# Altium schematic sheet Schmeiser Robo.SchDoc
size A3
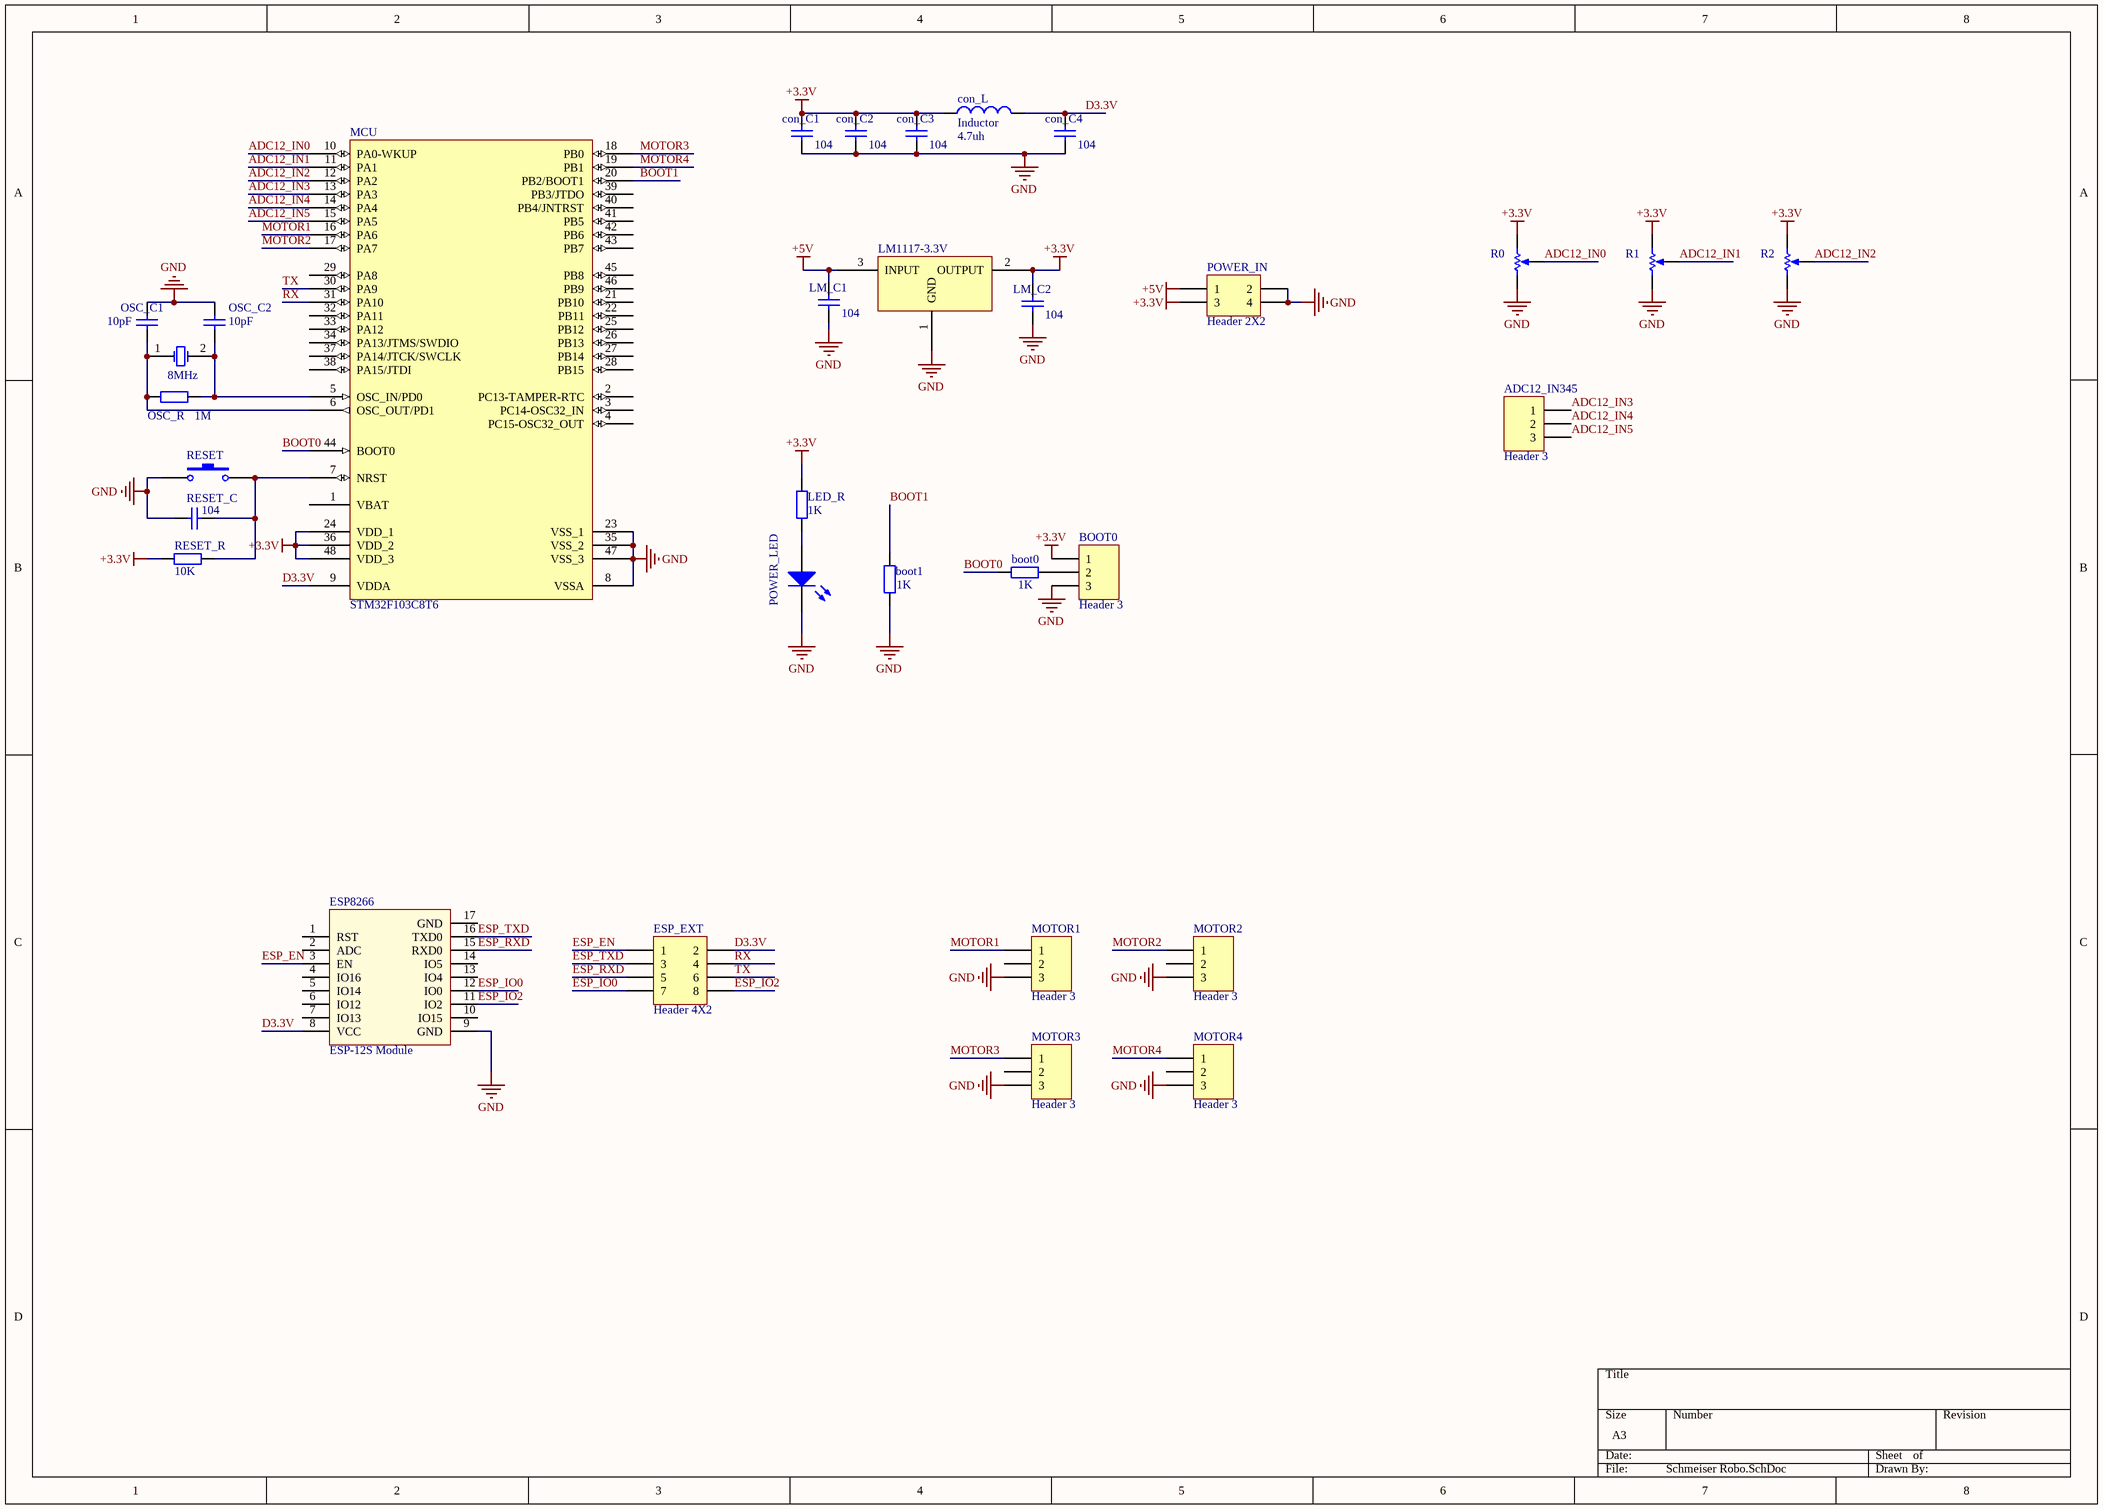
[diagram p0: Schmeiser Robo.SchDoc]

## Parts
(Parts that share a designator on the sheet are numbered #1, #2 ... from top to bottom, then left to right.)
8MHz  8M  [XTAL-C-SMD]  (value not drawn)
ADC12_IN345  Header 3  [HDR1X3]
BOOT0#1  Header 3  [HDR1X3]
boot0#2  value 1K  [0805-R-SMD]  (hidden comment: Res2)
boot1  value 1K  [0805-R-SMD]  (hidden comment: Res2)
con_C1  value 104  [0805-C-SMD]  (hidden comment: Cap)
con_C2  value 104  [0805-C-SMD]  (hidden comment: Cap)
con_C3  value 104  [0805-C-SMD]  (hidden comment: Cap)
con_C4  value 104  [0805-C-SMD]  (hidden comment: Cap)
con_L  Inductor  value 4.7uh  [0805-R-SMD]
ESP8266  ESP-12S Module  [ESP-12S Module]
ESP_EXT  Header 4X2  [HDR2X4]
LED_R  value 1K  [0805-R-SMD]  (hidden comment: Res2)
LM1117-3.3V  LM1117-3.3V  [SOT-223]  (value not drawn)
LM_C1  value 104  [0805-C-SMD]  (hidden comment: Cap)
LM_C2  value 104  [0805-C-SMD]  (hidden comment: Cap)
MCU  STM32F103C8T6  [LQFP48_N]
MOTOR1  Header 3  [HDR1X3]
MOTOR2  Header 3  [HDR1X3]
MOTOR3  Header 3  [HDR1X3]
MOTOR4  Header 3  [HDR1X3]
OSC_C1  value 10pF  [0805-C-SMD]  (hidden comment: Cap)
OSC_C2  value 10pF  [0805-C-SMD]  (hidden comment: Cap)
OSC_R  value 1M  [0805-R-SMD]  (hidden comment: Res2)
POWER_IN  Header 2X2  [HDR2X2]
POWER_LED  LED0  [LED-0805]  (value not drawn)
R0  RPot  [摇杆电位器]  (value not drawn)
R1  RPot  [摇杆电位器]  (value not drawn)
R2  RPot  [摇杆电位器]  (value not drawn)
RESET  RESET  [贴片按键]  (value not drawn)
RESET_C  value 104  [0805-C-SMD]  (hidden comment: Cap)
RESET_R  value 10K  [0805-R-SMD]  (hidden comment: Res2)

## Nets
+3.3V: BOOT0#1.1 con_C1.2 con_C2.2 con_C3.2 con_L.1 LED_R.1 LM1117-3.3V.2(OUTPUT) LM_C2.2 MCU.24(VDD_1) MCU.36(VDD_2) MCU.48(VDD_3) POWER_IN.3 R0.3(BOT) R1.3(BOT) R2.3(BOT) RESET_R.1
+5V: LM1117-3.3V.3(INPUT) LM_C1.2 POWER_IN.1
GND: BOOT0#1.3 boot1.1 con_C1.1 con_C2.1 con_C3.1 con_C4.1 ESP8266.9(GND) LM1117-3.3V.1(GND) LM_C1.1 LM_C2.1 MCU.8(VSSA) MCU.23(VSS_1) MCU.35(VSS_2) MCU.47(VSS_3) MOTOR1.3 MOTOR2.3 MOTOR3.3 MOTOR4.3 OSC_C1.2 OSC_C2.2 POWER_IN.2 POWER_IN.4 POWER_LED.2(K) R0.1(TOP) R1.1(TOP) R2.1(TOP) RESET.1 RESET_C.1
ADC12_IN0: MCU.10(PA0-WKUP) R0.2(TAP)
ADC12_IN1: MCU.11(PA1) R1.2(TAP)
ADC12_IN2: MCU.12(PA2) R2.2(TAP)
ADC12_IN3: ADC12_IN345.1 MCU.13(PA3)
ADC12_IN4: ADC12_IN345.2 MCU.14(PA4)
ADC12_IN5: ADC12_IN345.3 MCU.15(PA5)
BOOT0: boot0#2.1 MCU.44(BOOT0)
BOOT1: boot1.2 MCU.20(PB2/BOOT1)
D3.3V: con_C4.2 con_L.2 ESP8266.8(VCC) ESP_EXT.2 MCU.9(VDDA)
ESP_EN: ESP8266.3(EN) ESP_EXT.1
ESP_IO0: ESP8266.12(IO0) ESP_EXT.7
ESP_IO2: ESP8266.11(IO2) ESP_EXT.8
ESP_RXD: ESP8266.15(RXD0) ESP_EXT.5
ESP_TXD: ESP8266.16(TXD0) ESP_EXT.3
MOTOR1: MCU.16(PA6) MOTOR1.1
MOTOR2: MCU.17(PA7) MOTOR2.1
MOTOR3: MCU.18(PB0) MOTOR3.1
MOTOR4: MCU.19(PB1) MOTOR4.1
RX: ESP_EXT.4 MCU.31(PA10)
TX: ESP_EXT.6 MCU.30(PA9)
Net8MHz_1: 8MHz.1(OSC1) MCU.6(OSC_OUT/PD1) OSC_C1.1 OSC_R.1
Net8MHz_2: 8MHz.2(OSC2) MCU.5(OSC_IN/PD0) OSC_C2.1 OSC_R.2
NetBOOT0#1_2: BOOT0#1.2 boot0#2.2
NetLED_R_2: LED_R.2 POWER_LED.1(A)
NetMCU_7: MCU.7(NRST) RESET.2 RESET_C.2 RESET_R.2

Not connected (* = marked no-connect by the designer): ESP8266 1(RST) 2(ADC) 4(IO16) 5(IO14) 6(IO12) 7(IO13) 10(IO15) 13(IO4) 14(IO5) 17(GND); MCU 1(VBAT) 2(PC13-TAMPER-RTC) 3(PC14-OSC32_IN) 4(PC15-OSC32_OUT) 21(PB10) 22(PB11) 25(PB12) 26(PB13) 27(PB14) 28(PB15) 29(PA8) 32(PA11) 33(PA12) 34(PA13/JTMS/SWDIO) 37(PA14/JTCK/SWCLK) 38(PA15/JTDI) 39(PB3/JTDO) 40(PB4/JNTRST) 41(PB5) 42(PB6) 43(PB7) 45(PB8) 46(PB9); MOTOR1 2; MOTOR2 2; MOTOR3 2; MOTOR4 2

## Library data of the parts
8MHz = XTAL: Crystal Oscillator; Published: 8-Jun-2000; LatestRevisionDate: 17-Jul-2002; LatestRevisionNote: Re-released for DXP Platform.; PackageReference: R38; Publisher: Altium Limited; PackageDescription: Crystal, Thru-Hole; 2 Leads; Body 3.1 x 8.2 mm (Dia.xH)
ADC12_IN345 BOOT0#1 MOTOR1-MOTOR4 = Header 3: Header, 3-Pin; LatestRevisionDate: 17-Jul-2002; LatestRevisionNote: Re-released for DXP Platform.; Publisher: Altium Limited
boot0#2 boot1 LED_R OSC_R RESET_R = Res2: Resistor; Published: 8-Jun-2000; LatestRevisionDate: 17-Jul-2002; LatestRevisionNote: Re-released for DXP Platform.; PackageReference: AXIAL-0.4; Publisher: Altium Limited; PackageDescription: Axial Device, Thru-Hole; 2 Leads; 0.4 in Pin Spacing
con_C1-con_C4 LM_C1 LM_C2 OSC_C1 OSC_C2 RESET_C = Cap: Capacitor; Published: 8-Jun-2000; LatestRevisionDate: 17-Jul-2002; LatestRevisionNote: Re-released for DXP Platform.; PackageReference: RAD-0.3; Publisher: Altium Limited; PackageDescription: Radial Cap, Thru-Hole; 2 Leads; 0.3 in Pin Spacing
con_L = Inductor: Code_IEC: 1005; Published: 8-Jun-2000; LatestRevisionDate: 29-May-2009; LatestRevisionNote: IPC-7351 Footprint Added.; PackageReference: 0402-A; Publisher: Altium Limited; PackageDescription: Chip Inductor; Code_JEITA: 0402
ESP_EXT = Header 4X2: Header, 4-Pin, Dual row; LatestRevisionDate: 17-Jul-2002; LatestRevisionNote: Re-released for DXP Platform.; Publisher: Altium Limited
LM1117-3.3V = LM1117
MCU = STM32F103C8T6: STM32 ARM-based 32-bit MCU with 64 Kbytes Flash, 48-pin LQFP, Industrial Temperature; Published: 30-May-2008; DatasheetVersion: rev6, Mar-2008; PackageVersion: Mar-2008; PackageReference: LQFP48; Publisher: Altium Limited; PackageDescription: 48-Pin Low-Profile Quad Flat Pack, 7 x 7 mm Body, 0.5 mm Pitch (LQFP48); ComponentLink1Description: Manufacturer Link; ComponentLink1URL: www.st.com/stm32; ComponentLink2Description: Datasheet; ComponentLink2URL: http://www.st.com/stonline/products/literature/ds/13587.pdf
POWER_IN = Header 2X2: Header, 2-Pin, Dual row; LatestRevisionDate: 17-Jul-2002; LatestRevisionNote: Re-released for DXP Platform.; Publisher: Altium Limited
POWER_LED = LED0: Typical INFRARED GaAs LED; Published: 8-Jun-2000; LatestRevisionDate: 08-Jul-2005; LatestRevisionNote: Mech Layer 1 removed.; PackageReference: LED-0; Publisher: Altium Limited; PackageDescription: LED; 2 Leads
R0-R2 = RPot: Potentiometer; Sim Note: Enter the Resistance value and the set point into parameter fields.; Set Position: 0.5; Value: 1K; Published: 8-Jun-2000; LatestRevisionDate: 17-Jul-2002; LatestRevisionNote: Re-released for DXP Platform.; PackageReference: VR5; Publisher: Altium Limited; PackageDescription: Variable Resistor, Thru-Hole; 3 Leads
RESET = SW-PB: Switch; Published: 24-Mar-1999; LatestRevisionDate: 17-Jul-2002; LatestRevisionNote: Re-released for DXP Platform.; PackageReference: SPST-2; Publisher: Altium Limited; PackageDescription: Switch; 2 Leads